# Altium schematic sheet PTSignals.SchDoc: Set in Document Options » Parameters » Title
size Tabloid; Author: Set in Document Options » Parameters » Author + Contact info
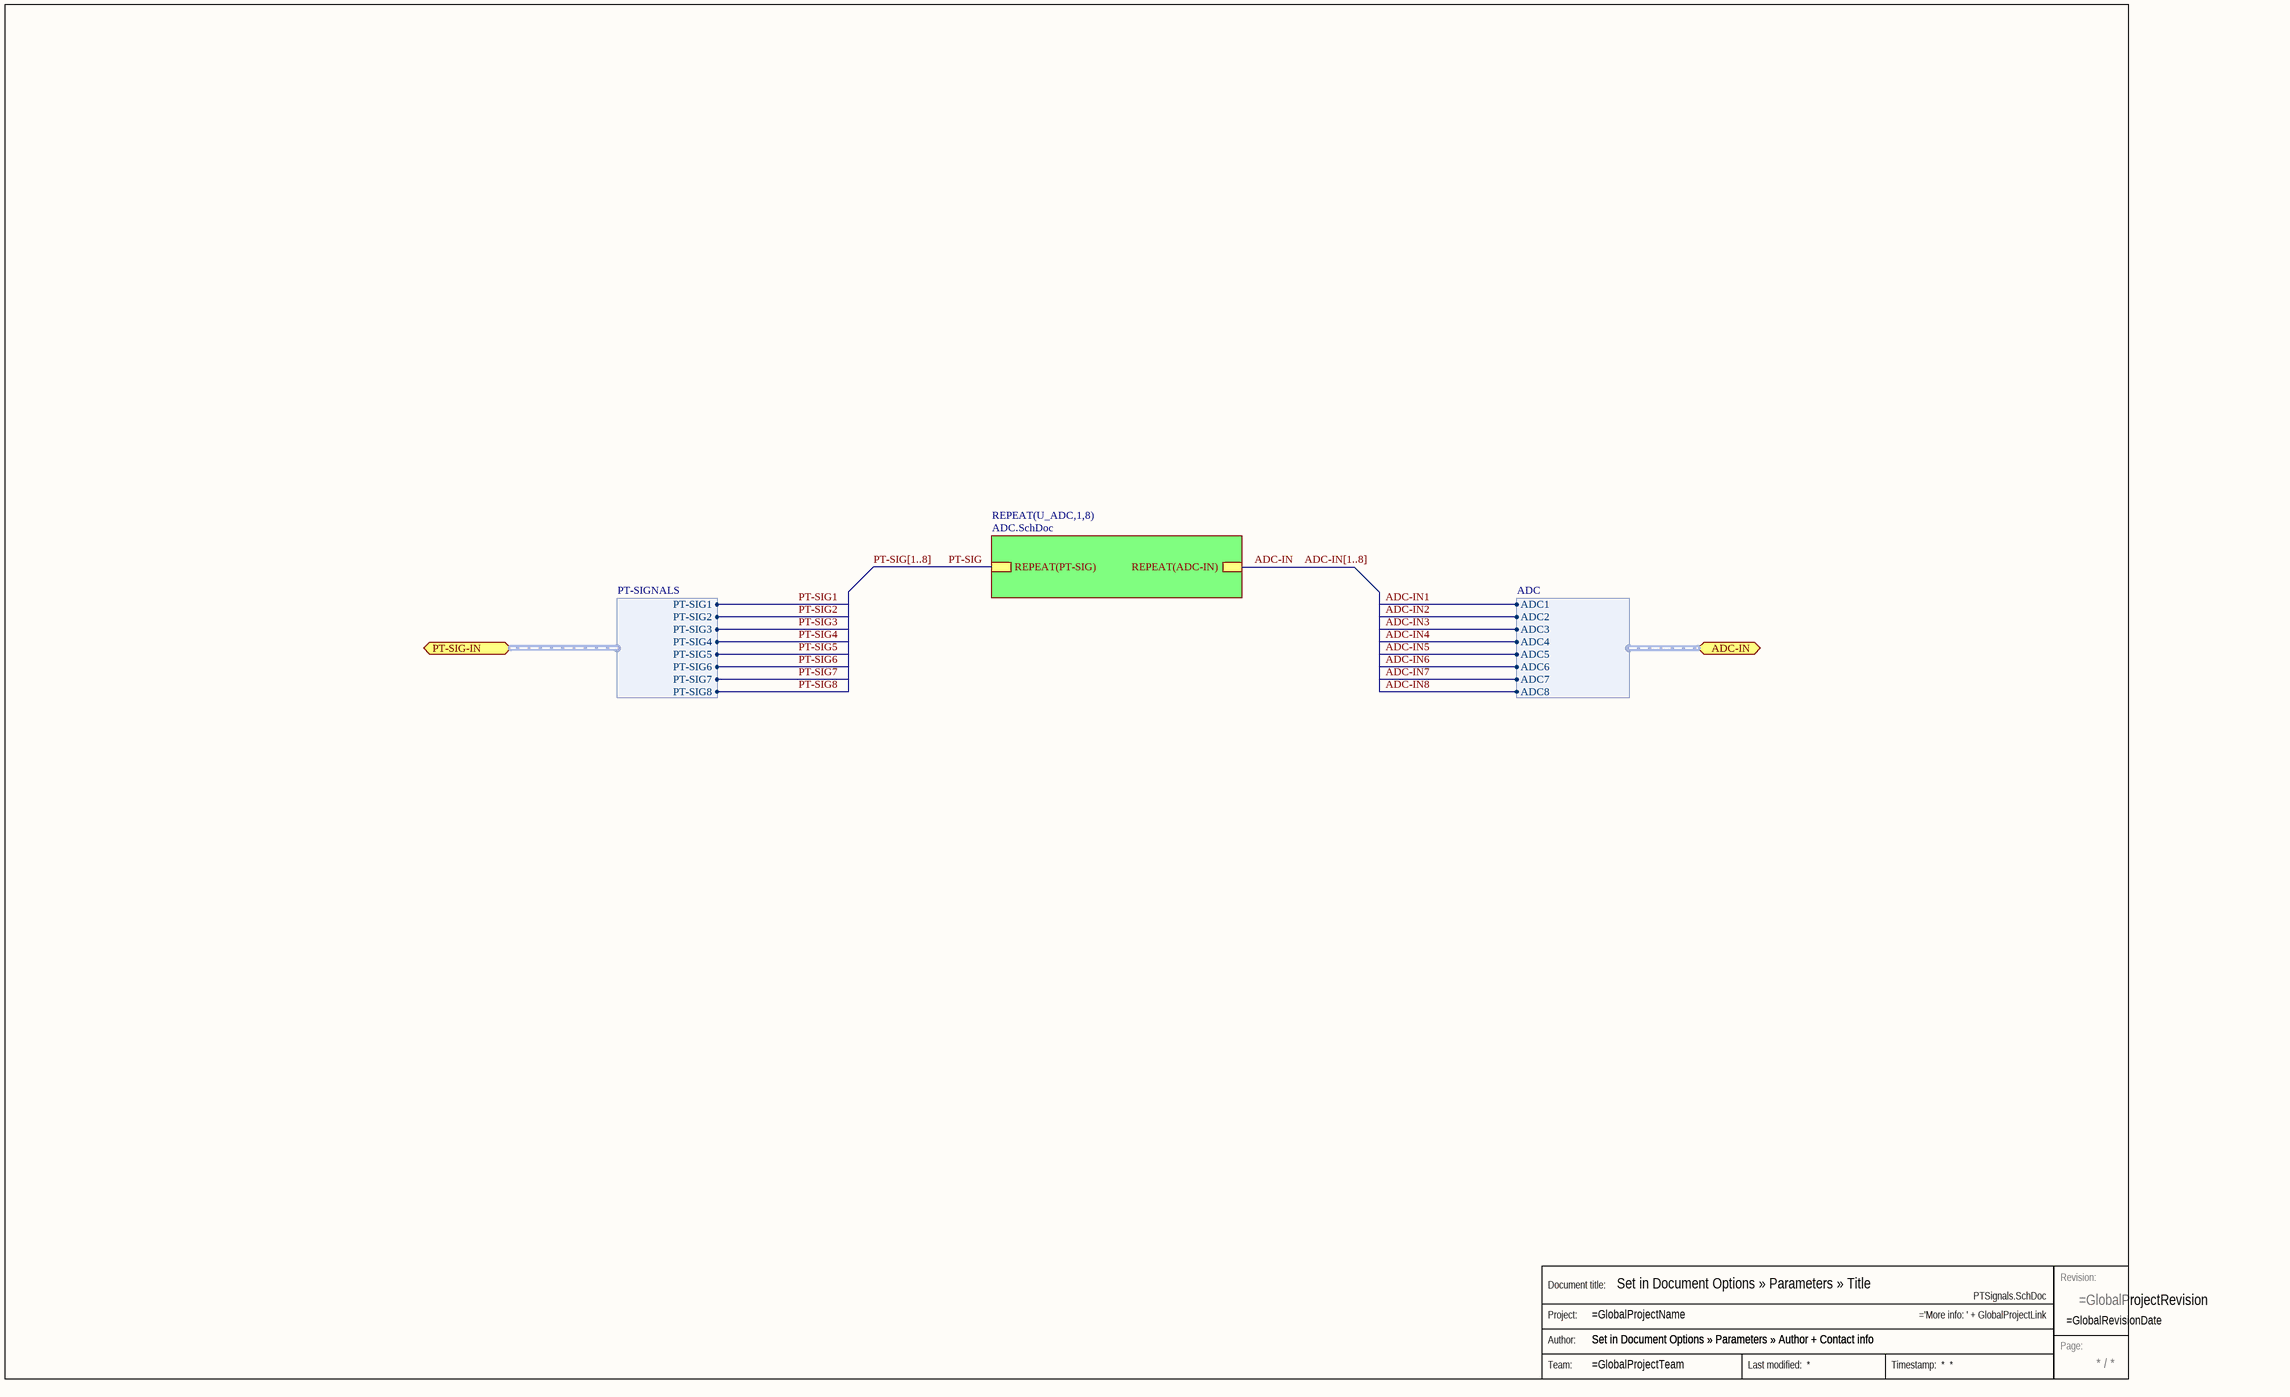
[diagram p0: PTSignals.SchDoc]

## Parts
Stamp  Stamp  (value not drawn)  (graphical)

## Sub-sheets
REPEAT(U_ADC,1,8) = ADC.SchDoc: REPEAT(PT-SIG), REPEAT(ADC-IN)

## Ports
ADC-IN (harness ADC), PT-SIG-IN (harness PT-SIGNALS)

## Harnesses
ADC: ADC1, ADC2, ADC3, ADC4, ADC5, ADC6, ADC7, ADC8
PT-SIGNALS: PT-SIG1, PT-SIG2, PT-SIG3, PT-SIG4, PT-SIG5, PT-SIG6, PT-SIG7, PT-SIG8

## Nets
ADC-IN: sheet REPEAT(U_ADC,1,8)/REPEAT(ADC-IN)
ADC-IN1: port ADC-IN.ADC1
ADC-IN2: port ADC-IN.ADC2
ADC-IN3: port ADC-IN.ADC3
ADC-IN4: port ADC-IN.ADC4
ADC-IN5: port ADC-IN.ADC5
ADC-IN6: port ADC-IN.ADC6
ADC-IN7: port ADC-IN.ADC7
ADC-IN8: port ADC-IN.ADC8
PT-SIG: sheet REPEAT(U_ADC,1,8)/REPEAT(PT-SIG)
PT-SIG1: port PT-SIG-IN.PT-SIG1
PT-SIG2: port PT-SIG-IN.PT-SIG2
PT-SIG3: port PT-SIG-IN.PT-SIG3
PT-SIG4: port PT-SIG-IN.PT-SIG4
PT-SIG5: port PT-SIG-IN.PT-SIG5
PT-SIG6: port PT-SIG-IN.PT-SIG6
PT-SIG7: port PT-SIG-IN.PT-SIG7
PT-SIG8: port PT-SIG-IN.PT-SIG8

## Buses and harness runs
bus ADC-IN[1..8]
bus PT-SIG[1..8]

## Notes on the sheet
- (in symbol Stamp) Revision:; Document title:; Project:; Author:; Page:; Team: